# Altium project SmartWatch.PrjPcb
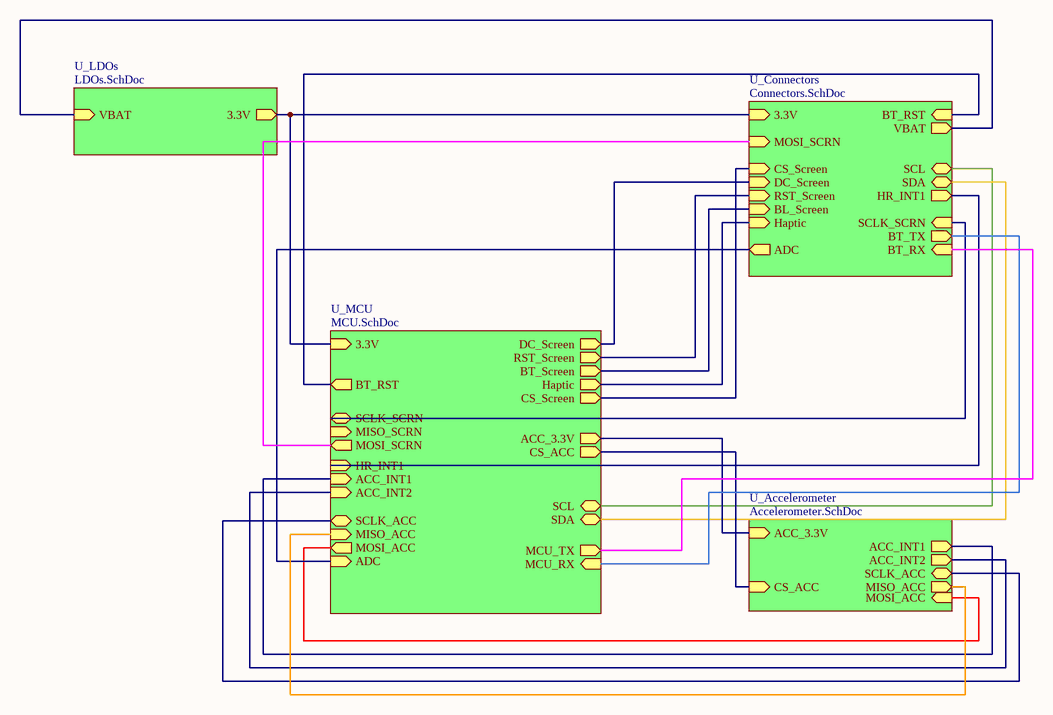
[diagram p0: TLD.SchDoc]
5 sheets, 46 parts. Net scope: hierarchical (ports join the sheet entries above them; power ports are global).
Board file: Smart_Watch.PcbDoc
Sheets:
  TLD.SchDoc
    U_Connectors = Connectors.SchDoc
    U_MCU = MCU.SchDoc
    U_Accelerometer = Accelerometer.SchDoc
    U_LDOs = LDOs.SchDoc

## Sheet TLD.SchDoc
size A; SheetNumber: 1; SheetTotal: 4

### Sub-sheets
U_Accelerometer = Accelerometer.SchDoc: ACC_INT1 (out), ACC_INT2 (out), CS_ACC (in), ACC_3.3V (in), SCLK_ACC (bidir), MISO_ACC (out), MOSI_ACC (in)
U_Connectors = Connectors.SchDoc: Haptic (in), 3.3V (in), CS_Screen (in), DC_Screen (in), RST_Screen (in), BL_Screen (in), SDA (bidir), HR_INT1 (out), SCL (bidir), BT_TX (out), BT_RX (in), VBAT (out), BT_RST (in), ADC (out), MOSI_SCRN (in), SCLK_SCRN (in)
U_LDOs = LDOs.SchDoc: 3.3V (out), VBAT (in)
U_MCU = MCU.SchDoc: 3.3V (in), Haptic (out), BT_Screen (out), RST_Screen (out), DC_Screen (out), CS_Screen (out), CS_ACC (out), HR_INT1 (in), ACC_INT1 (in), ACC_INT2 (in), ACC_3.3V (out), MCU_TX (out), MCU_RX (in), SCL (bidir), SDA (bidir), BT_RST (out), ADC (in), SCLK_SCRN (bidir), MISO_SCRN (in), MOSI_SCRN (out), SCLK_ACC (bidir), MISO_ACC (in), MOSI_ACC (out)

### Nets
3.3V: sheet U_Connectors/3.3V, sheet U_MCU/3.3V, sheet U_LDOs/3.3V
ACC_3.3V: sheet U_MCU/ACC_3.3V, sheet U_Accelerometer/ACC_3.3V
VBAT: sheet U_Connectors/VBAT, sheet U_LDOs/VBAT
ACC_INT1: sheet U_MCU/ACC_INT1, sheet U_Accelerometer/ACC_INT1
ACC_INT2: sheet U_MCU/ACC_INT2, sheet U_Accelerometer/ACC_INT2
ADC: sheet U_Connectors/ADC, sheet U_MCU/ADC
BL_Screen: sheet U_Connectors/BL_Screen, sheet U_MCU/BT_Screen
BT_RST: sheet U_Connectors/BT_RST, sheet U_MCU/BT_RST
BT_RX: sheet U_Connectors/BT_RX, sheet U_MCU/MCU_TX
BT_TX: sheet U_Connectors/BT_TX, sheet U_MCU/MCU_RX
CS_ACC: sheet U_MCU/CS_ACC, sheet U_Accelerometer/CS_ACC
CS_Screen: sheet U_Connectors/CS_Screen, sheet U_MCU/CS_Screen
DC_Screen: sheet U_Connectors/DC_Screen, sheet U_MCU/DC_Screen
Haptic: sheet U_Connectors/Haptic, sheet U_MCU/Haptic
HR_INT1: sheet U_Connectors/HR_INT1, sheet U_MCU/HR_INT1
MISO_ACC: sheet U_MCU/MISO_ACC, sheet U_Accelerometer/MISO_ACC
MOSI_ACC: sheet U_MCU/MOSI_ACC, sheet U_Accelerometer/MOSI_ACC
MOSI_SCRN: sheet U_Connectors/MOSI_SCRN, sheet U_MCU/MOSI_SCRN
RST_Screen: sheet U_Connectors/RST_Screen, sheet U_MCU/RST_Screen
SCL: sheet U_Connectors/SCL, sheet U_MCU/SCL
SCLK_ACC: sheet U_MCU/SCLK_ACC, sheet U_Accelerometer/SCLK_ACC
SCLK_SCRN: sheet U_Connectors/SCLK_SCRN, sheet U_MCU/SCLK_SCRN
SDA: sheet U_Connectors/SDA, sheet U_MCU/SDA

## Sheet Connectors.SchDoc
size A; SheetNumber: 2; SheetTotal: 4
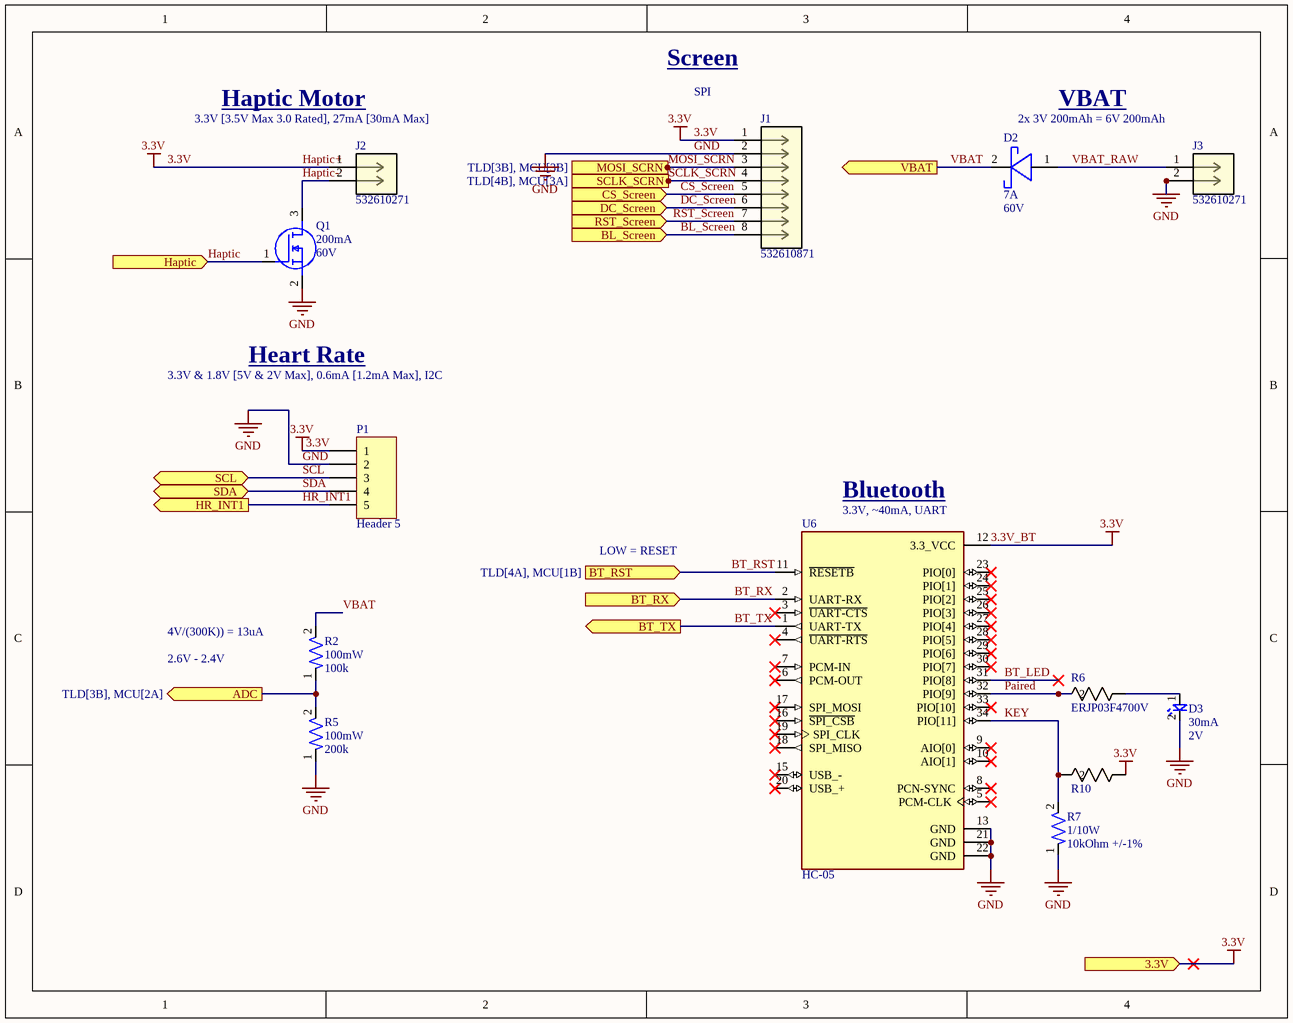
[diagram p1: Connectors.SchDoc]

### Parts
D2  Forward Current: 7A  Reverse Voltage (DC): 60V  [DO-POWERDI5]  (hidden comment: PDS760-13)
D3  Forward Current: 30mA  Forward Voltage: 2V  [LED-0603]  (hidden comment: BL-HKC36G-AV-TRB)
J1  532610871  [CONN_532610001-SD_08_MOL]
J2  532610271  [CONN_532610001-SD_02_MOL]
J3  532610271  [CONN_532610001-SD_02_MOL]
P1  Header 5  [HDR1X5]
Q1  Continuous Current: 200mA  Voltage: 60V  [IC-SOT23-3]  (hidden comment: T2N7002AK,LM)
R2  Power: 100mW  Resistance: 100k  [RES-0603]  (hidden comment: RC0603FR-07100KL)
R5  Power: 100mW  Resistance: 200k  [RES-0603]  (hidden comment: RC0603FR-07200KL)
R6  ERJP03F4700V  [RES_ERJP03_PAN]
R7  Power Rating: 1/10W  Resistance: 10kOhm +/-1%  [RES-0603]  (hidden comment: RC0603FR-0710KP)
R10  CRCW12100000Z0EA  [RES_CRCW_1210_VIS]  (value not drawn)
U6  HC-05  [XCVR_HC-05]

### Ports
3.3V (in, see TLD[3A], LDOs[1A], MCU[4D]), ADC (out, see TLD[3B], MCU[2A]), BL_Screen (in, see TLD[3B]), BT_RST (in, see TLD[4A], MCU[1B]), BT_RX (in, see TLD[4B]), BT_TX (out, see TLD[4B]), CS_Screen (in, see TLD[3B], MCU[1A]), DC_Screen (in, see TLD[3B], MCU[1A]), Haptic (in, see TLD[3B], MCU[1A]), HR_INT1 (out, see TLD[4B], MCU[1B]), MOSI_SCRN (in, see TLD[3B], MCU[3B]), RST_Screen (in, see TLD[3B], MCU[1A]), SCL (bidir, see TLD[4B], MCU[3D]), SCLK_SCRN (in, see TLD[4B], MCU[3A]), SDA (bidir, see TLD[4B], MCU[3D]), VBAT (out, see TLD[4B], LDOs[1A])

### Nets
3.3V: J1.1 J2.1 P1.1 R10.1 U6.12(3.3_VCC) ; port 3.3V  [also labelled 3.3V_BT, Haptic+]
GND: D3.2 J1.2 J3.2 P1.2 Q1.2(S) R5.1 R7.1 U6.13(GND) U6.21(GND) U6.22(GND)
VBAT: D2.2(ANODE) R2.2 ; port VBAT
ADC: R2.1 R5.2 ; port ADC
BL_Screen: J1.8 ; port BL_Screen
BT_LED: U6.31(PIO[8])
BT_RST: U6.11(~{RESETB}) ; port BT_RST
BT_RX: U6.2(UART-RX) ; port BT_RX
BT_TX: U6.1(UART-TX) ; port BT_TX
CS_Screen: J1.5 ; port CS_Screen
DC_Screen: J1.6 ; port DC_Screen
Haptic: Q1.1(G) ; port Haptic
Haptic-: J2.2 Q1.3(D)
HR_INT1: P1.5 ; port HR_INT1
KEY: R7.2 R10.2 U6.34(PIO[11])
MOSI_SCRN: J1.3 ; port MOSI_SCRN
Paired: R6.2 U6.32(PIO[9])
RST_Screen: J1.7 ; port RST_Screen
SCL: P1.3 ; port SCL
SCLK_SCRN: J1.4 ; port SCLK_SCRN
SDA: P1.4 ; port SDA
VBAT_RAW: D2.1(CATHODE) J3.1
NetD3_1: D3.1 R6.1

Not connected (* = marked no-connect by the designer): U6 3(~{UART-CTS})* 4(~{UART-RTS})* 5(PCM-CLK)* 6(PCM-OUT)* 7(PCM-IN)* 8(PCN-SYNC)* 9(AIO[0])* 10(AIO[1])* 15(USB_-)* 16(~{SPI_CSB})* 17(SPI_MOSI)* 18(SPI_MISO)* 19(SPI_CLK)* 20(USB_+)* 23(PIO[0])* 24(PIO[1])* 25(PIO[2])* 26(PIO[3])* 27(PIO[4])* 28(PIO[5])* 29(PIO[6])* 30(PIO[7])* 33(PIO[10])*

### Notes on the sheet
- Screen
- SPI
- (near J2) 3.3V [3.5V Max 3.0 Rated], 27mA [30mA Max]
- Haptic Motor
- 2x 3V 200mAh = 6V 200mAh
- VBAT
- Heart Rate
- 3.3V & 1.8V [5V & 2V Max], 0.6mA [1.2mA Max], I2C
- (near U6) Bluetooth
- LOW = RESET
- (near U6) 3.3V, ~40mA, UART
- (near R2) 4V/(300K)) = 13uA
- 2.6V - 2.4V

### Library data of the parts
D2 = DIO-SCHOTTKY-0001: DIODE SCHOTTKY 60V 7A POWERDI5; ComponentLink1Description: Datasheet; ComponentLink1URL: https://www.diodes.com/assets/Datasheets/PDS760.pdf
D3 = LED-0001: LED YELLOW CLEAR 0603 SMD; ComponentLink1Description: Datasheet; ComponentLink1URL: https://www.americanbrightled.com/pdffiles/led-components/smt/BL-HKC36G-AV-TRB.pdf
J1 = Header-PICO-8: No Description Available; Mfr_Name: Molex Connector Corporation; RefDes: RefDes; Type: Type; ComponentLink1Description: Datasheet; ComponentLink1URL: https://www.molex.com/content/dam/molex/molex-dot-com/products/automated/en-us/salesdrawingpdf/532/53261/532610871_sd.pdf?inline
J2 J3 = Header-PICO-2: No Description Available; Mfr_Name: Molex Connector Corporation; RefDes: RefDes; Type: Type; ComponentLink1Description: Datasheet; ComponentLink1URL: https://www.molex.com/content/dam/molex/molex-dot-com/products/automated/en-us/salesdrawingpdf/532/53261/532610271_sd.pdf?inline
P1 = Header 5: Header, 5-Pin; LatestRevisionDate: 17-Jul-2002; LatestRevisionNote: Re-released for DXP Platform.; Publisher: Altium Limited
Q1 = NMOS-200MA-0001: MOSFET N-CH 60V 200MA SOT23; ComponentLink1Description: Datasheet; ComponentLink1URL: https://toshiba.semicon-storage.com/info/T2N7002AK_datasheet_en_20150401.pdf?did=29712&prodName=T2N7002AK
R2 = RES-100k-0001: RES SMD 100K OHM 1% 1/10W 0603; Tolerance: 1%; Size: 0603; ComponentLink1Description: Datasheet; ComponentLink1URL: https://www.yageo.com/upload/media/product/products/datasheet/rchip/PYu-RC_Group_51_RoHS_L_12.pdf
R5 = RES-200k-0001: RES SMD 200K OHM 1% 1/10W 0603; Tolerance: 1%; Size: 0603; ComponentLink1Description: Datasheet; ComponentLink1URL: https://www.yageo.com/upload/media/product/products/datasheet/rchip/PYu-RC_Group_51_RoHS_L_12.pdf
R6 = RES-470-0603: 470 Ohms ±1% 0.2W, 1/5W Chip Resistor 0603 (1608 Metric) Automotive AEC-Q200, Pulse Withstanding Thick Film; Mfr_Name: Panasonic; ComponentLink1Description: Datasheet; ComponentLink1URL: https://industrial.panasonic.com/cdbs/www-data/pdf/RDO0000/AOA0000C331.pdf
R7 = RES-10K-0002: RES SMD 10K OHM 1% 1/10W 0603; Manufacturer: YAGEO; Assembled?: no; Manufacturer Part Number: RC0603FR-0710KP; Package Size: 0603
R10 = RES-0-1: No Description Available; Mfr_Name: Vishay; ComponentLink1Description: Datasheet; ComponentLink1URL: https://www.vishay.com/docs/20035/dcrcwe3.pdf
U6 = HC-05: Bluetooth to Serial Port Module; MF: ITead Studio; SnapEDA_Link: https://www.snapeda.com/parts/HC-05/ITEAD/view-part/?ref=snap; Package: Module ITead Studio; Value: *; MP: HC-05; Check_prices: https://www.snapeda.com/parts/HC-05/ITEAD/view-part/?ref=eda; ComponentLink1Description: Datasheet; ComponentLink1URL: https://components101.com/sites/default/files/component_datasheet/HC06%20Bluetooth%20Module%20Datasheet.pdf; ComponentLink2Description: Datasheet2; ComponentLink2URL: https://dcc-ex.com/reference/hardware/bluetooth/hc-05-06.html#gsc.tab=0

## Sheet MCU.SchDoc
size A; SheetNumber: 3; SheetTotal: 4
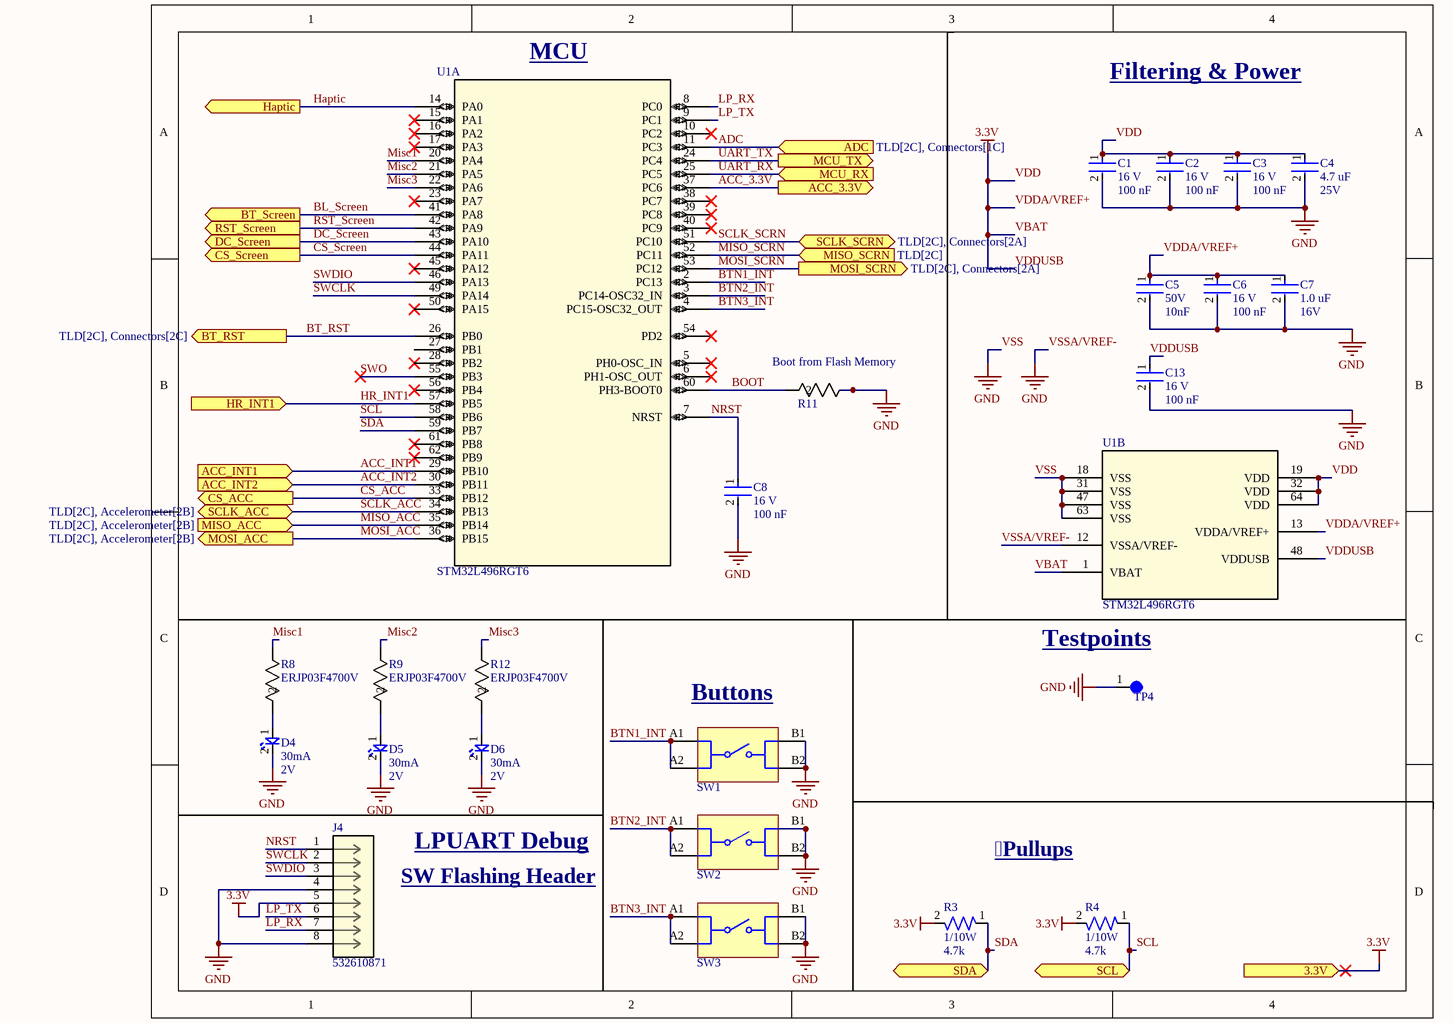
[diagram p2: MCU.SchDoc]

### Parts
C1  Voltage Rating: 16 V  Capacitance: 100 nF  [CAP-0402]  (hidden comment: CC0402KRX7R7BB104)
C2  Voltage Rating: 16 V  Capacitance: 100 nF  [CAP-0402]  (hidden comment: CC0402KRX7R7BB104)
C3  Voltage Rating: 16 V  Capacitance: 100 nF  [CAP-0402]  (hidden comment: CC0402KRX7R7BB104)
C4  Capacitance: 4.7 uF  Voltage: 25V  [CAP-0603]  (hidden comment: CC0603KRX5R8BB475)
C5  Voltage: 50V  Capacitance: 10nF  [CAP-0805]  (hidden comment: GRM2195C1H103JA01D)
C6  Voltage Rating: 16 V  Capacitance: 100 nF  [CAP-0402]  (hidden comment: CC0402KRX7R7BB104)
C7  Capacitance: 1.0 uF  Voltage: 16V  [CAP-0603]  (hidden comment: CC0603KRX7R7BB105)
C8  Voltage Rating: 16 V  Capacitance: 100 nF  [CAP-0402]  (hidden comment: CC0402KRX7R7BB104)
C13  Voltage Rating: 16 V  Capacitance: 100 nF  [CAP-0402]  (hidden comment: CC0402KRX7R7BB104)
D4  Forward Current: 30mA  Forward Voltage: 2V  [LED-0603]  (hidden comment: BL-HKC36G-AV-TRB)
D5  Forward Current: 30mA  Forward Voltage: 2V  [LED-0603]  (hidden comment: BL-HKC36G-AV-TRB)
D6  Forward Current: 30mA  Forward Voltage: 2V  [LED-0603]  (hidden comment: BL-HKC36G-AV-TRB)
J4  532610871  [CONN_532610001-SD_08_MOL]
R3  Power: 1/10W  Resistance: 4.7k  [RES-0603]  (hidden comment: RC0603FR-074K7L)
R4  Power: 1/10W  Resistance: 4.7k  [RES-0603]  (hidden comment: RC0603FR-074K7L)
R8  ERJP03F4700V  [RES_ERJP03_PAN]
R9  ERJP03F4700V  [RES_ERJP03_PAN]
R11  CRCW12100000Z0EA  [RES_CRCW_1210_VIS]  (value not drawn)
R12  ERJP03F4700V  [RES_ERJP03_PAN]
SW1  434351045816  [434351045816]  (value not drawn)
SW2  434351045816  [434351045816]  (value not drawn)
SW3  434351045816  [434351045816]  (value not drawn)
TP4  5003  [TEST-POINT-0001]  (value not drawn)
U1  STM32L496RGT6  [LQFP64-10x10mm_STM]  (parts A,B of 2)

### Ports
3.3V (in, see TLD[2B], Connectors[4D], LDOs[1A]), ACC_3.3V (out, see TLD[3C], Accelerometer[4D]), ACC_INT1 (in, see TLD[2C], Accelerometer[2B]), ACC_INT2 (in, see TLD[2C], Accelerometer[2B]), ADC (in, see TLD[2C], Connectors[1C]), BT_RST (out, see TLD[2C], Connectors[2C]), BT_Screen (out, see TLD[3B]), CS_ACC (out, see TLD[3C], Accelerometer[2B]), CS_Screen (out, see TLD[3C], Connectors[2A]), DC_Screen (out, see TLD[3B], Connectors[2A]), Haptic (out, see TLD[3C], Connectors[1B]), HR_INT1 (in, see TLD[2C], Connectors[1B]), MCU_RX (in, see TLD[3C]), MCU_TX (out, see TLD[3C]), MISO_ACC (in, see TLD[2C], Accelerometer[2B]), MISO_SCRN (in, see TLD[2C]), MOSI_ACC (out, see TLD[2C], Accelerometer[2B]), MOSI_SCRN (out, see TLD[2C], Connectors[2A]), RST_Screen (out, see TLD[3B], Connectors[2A]), SCL (bidir, see TLD[3C], Connectors[1B]), SCLK_ACC (bidir, see TLD[2C], Accelerometer[2B]), SCLK_SCRN (bidir, see TLD[2C], Connectors[2A]), SDA (bidir, see TLD[3C], Connectors[1B])

### Nets
3.3V: C1.1 C2.1 C3.1 C4.1 C5.1 C6.1 C7.1 C13.1 J4.5 R3.2 R4.2 U1.1(VBAT) U1.13(VDDA/VREF+) U1.19(VDD) U1.32(VDD) U1.48(VDDUSB) U1.64(VDD) ; port 3.3V  [also labelled VBAT, VDD, VDDA/VREF+, VDDUSB]
ACC_3.3V: U1.37(PC6) ; port ACC_3.3V
GND: C1.2 C2.2 C3.2 C4.2 C5.2 C6.2 C7.2 C8.2 C13.2 D4.2 D5.2 D6.2 J4.4 J4.8 R11.1 SW1.B1 SW1.B2 SW2.B1 SW2.B2 SW3.B1 SW3.B2 TP4.1 U1.12(VSSA/VREF-) U1.18(VSS) U1.31(VSS) U1.47(VSS) U1.63(VSS)  [also labelled VSS, VSSA/VREF-]
ACC_INT1: U1.29(PB10) ; port ACC_INT1
ACC_INT2: U1.30(PB11) ; port ACC_INT2
ADC: U1.11(PC3) ; port ADC
BL_Screen: U1.41(PA8) ; port BT_Screen
BOOT: R11.2 U1.60(PH3-BOOT0)
BT_RST: U1.26(PB0) ; port BT_RST
BTN1_INT: SW1.A1 SW1.A2 U1.2(PC13)
BTN2_INT: SW2.A1 SW2.A2 U1.3(PC14-OSC32_IN)
BTN3_INT: SW3.A1 SW3.A2 U1.4(PC15-OSC32_OUT)
CS_ACC: U1.33(PB12) ; port CS_ACC
CS_Screen: U1.44(PA11) ; port CS_Screen
DC_Screen: U1.43(PA10) ; port DC_Screen
Haptic: U1.14(PA0) ; port Haptic
HR_INT1: U1.57(PB5) ; port HR_INT1
LP_RX: J4.7 U1.8(PC0)
LP_TX: J4.6 U1.9(PC1)
Misc1: R8.1 U1.20(PA4)
Misc2: R9.1 U1.21(PA5)
Misc3: R12.1 U1.22(PA6)
MISO_ACC: U1.35(PB14) ; port MISO_ACC
MISO_SCRN: U1.52(PC11) ; port MISO_SCRN
MOSI_ACC: U1.36(PB15) ; port MOSI_ACC
MOSI_SCRN: U1.53(PC12) ; port MOSI_SCRN
NRST: C8.1 J4.1 U1.7(NRST)
RST_Screen: U1.42(PA9) ; port RST_Screen
SCL: R4.1 U1.58(PB6) ; port SCL
SCLK_ACC: U1.34(PB13) ; port SCLK_ACC
SCLK_SCRN: U1.51(PC10) ; port SCLK_SCRN
SDA: R3.1 U1.59(PB7) ; port SDA
SWCLK: J4.2 U1.49(PA14)
SWDIO: J4.3 U1.46(PA13)
SWO: U1.55(PB3)
UART_RX: U1.25(PC5) ; port MCU_RX  [project net BT_TX]
UART_TX: U1.24(PC4) ; port MCU_TX  [project net BT_RX]
NetD4_1: D4.1 R8.2
NetD5_1: D5.1 R9.2
NetD6_1: D6.1 R12.2

Not connected (* = marked no-connect by the designer): U1 5(PH0-OSC_IN)* 6(PH1-OSC_OUT)* 10(PC2)* 15(PA1)* 16(PA2)* 17(PA3)* 23(PA7)* 27(PB1) 28(PB2)* 38(PC7)* 39(PC8)* 40(PC9)* 45(PA12)* 50(PA15)* 54(PD2)* 56(PB4)* 61(PB8)* 62(PB9)*

### Notes on the sheet
- (near U1) MCU
- Filtering & Power
- (near R11) Boot from Flash Memory
- (near SW1) Buttons
- Testpoints
- SW Flashing Header
- LPUART Debug
- Pullups

### Library data of the parts
C1-C3 C6 C8 C13 = CAP-0.1U-0001: CAP CER 0.1UF 16V X7R 0402; ComponentLink2Description: Datasheet; ComponentLink2URL: https://www.yageo.com/upload/media/product/productsearch/datasheet/mlcc/UPY-GPHC_X7R_6.3V-to-250V_24.pdf; Device Class: Ceramic; Size: 0402
C4 = CAP-4.7U-0001: CAP CER 4.7UF 25V X5R 0603; Device Class: Ceramic; Size: 0603
C5 = CAP-10N-0001: CAP CER 10000PF 50V C0G/NP0 0805; Device Class: Ceramic; Size: 0805; ComponentLink1Description: Datasheet; ComponentLink1URL: https://search.murata.co.jp/Ceramy/image/img/A01X/G101/ENG/GRM2195C1H103JA01-01.pdf
C7 = CAP-1U-0002: CAP CER 1UF 16V X7R 0603; Device Class: Ceramic; Size: 0603
D4-D6 = LED-0001: LED YELLOW CLEAR 0603 SMD; ComponentLink1Description: Datasheet; ComponentLink1URL: https://www.americanbrightled.com/pdffiles/led-components/smt/BL-HKC36G-AV-TRB.pdf
J4 = Header-PICO-8: as J1 on sheet Connectors; RefDes: RefDes; Type: Type; ComponentLink1Description: Datasheet; ComponentLink1URL: https://www.molex.com/content/dam/molex/molex-dot-com/products/automated/en-us/salesdrawingpdf/532/53261/532610871_sd.pdf?inline
R3 R4 = RES-4.7k-0001: RES 4.7K OHM 1% 1/10W 0603; Tolerance: 1%; Size: 0603; ComponentLink1Description: Datasheet; ComponentLink1URL: https://www.yageo.com/upload/media/product/products/datasheet/rchip/PYu-RC_Group_51_RoHS_L_12.pdf
R8 R9 R12 = RES-470-0603: as R6 on sheet Connectors; ComponentLink1Description: Datasheet; ComponentLink1URL: https://industrial.panasonic.com/cdbs/www-data/pdf/RDO0000/AOA0000C331.pdf
R11 = RES-0-1: as R10 on sheet Connectors; ComponentLink1Description: Datasheet; ComponentLink1URL: https://www.vishay.com/docs/20035/dcrcwe3.pdf
SW1-SW3 = Button-NO-90_1: WS-TASU SMT Tact Switch 4.7x3.5mm side push, SPST-NO, 12VDC, 50mA, 160g; Manufacturer: Wurth Elektronik; Washable: No; ComponentLink1Description: Website Link; ComponentLink1URL: https://www.we-online.com/redexpert/article/434351045816?ad; ComponentLink2Description: Datasheet Link; ComponentLink2URL: https://www.we-online.com/redexpert/spec/434351045816?ad; Manufacturer Part Number: 434351045816; Category: Tact Switches; Match Code: WS-TASU; Mount: Surface Mount; Operating Temperature Max: 85°C; Operating Temperature Min: -40°C; Packaging: Tape and Reel; Length: 4.7mm; Width: 3.5mm; Height: 1.65mm; Circuit: SPST-NO; Contact Material: Stainless Steel; Contact Plating: Silver; Operation Force: 160g; Rated Current: 50mA; Rated Voltage: 12VDC; Terminal Material: Copper Alloy; Terminal Plating: Silver
TP4 = TEST-POINT-0001: Oranange PC Test Point, Miniature Phoisphor Bronze Silver Plating Through Hole Mounting Type
U1 = STM32L496RGT6: ARM® Cortex®-M4 STM32L4 Microcontroller IC 32-Bit Single-Core 80MHz 1MB (1M x 8) FLASH 64-LQFP (10x10); Mfr_Name: STMicroelectronics; RefDes: RefDes; Type: Type; ComponentLink1Description: Datasheet; ComponentLink1URL: https://www.st.com/resource/en/datasheet/stm32l496ae.pdf

## Sheet Accelerometer.SchDoc
size A; SheetNumber: 4; SheetTotal: 5
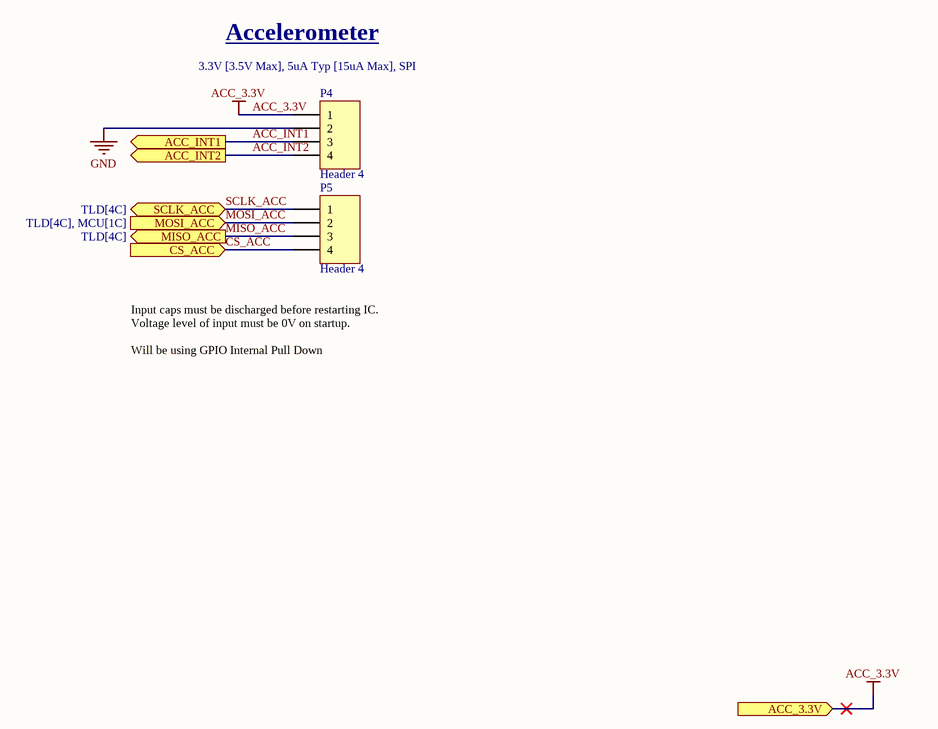
[diagram p3: Accelerometer.SchDoc]

### Parts
P4  Header 4  [HDR1X4]
P5  Header 4  [HDR1X4]

### Ports
ACC_3.3V (in, see TLD[3C], MCU[2A]), ACC_INT1 (out, see TLD[4C], MCU[1B]), ACC_INT2 (out, see TLD[4C], MCU[1B]), CS_ACC (in, see TLD[3C], MCU[1B]), MISO_ACC (out, see TLD[4C]), MOSI_ACC (in, see TLD[4C], MCU[1C]), SCLK_ACC (bidir, see TLD[4C])

### Nets
ACC_3.3V: P4.1 ; port ACC_3.3V
GND: P4.2
ACC_INT1: P4.3 ; port ACC_INT1
ACC_INT2: P4.4 ; port ACC_INT2
CS_ACC: P5.4 ; port CS_ACC
MISO_ACC: P5.3 ; port MISO_ACC
MOSI_ACC: P5.2 ; port MOSI_ACC
SCLK_ACC: P5.1 ; port SCLK_ACC

### Notes on the sheet
- (near P4) 3.3V [3.5V Max], 5uA Typ [15uA Max], SPI
- Accelerometer
- (near P5) Input caps must be discharged before restarting IC.
  Voltage level of input must be 0V on startup.
  Will be using GPIO Internal Pull Down

### Library data of the parts
P4 P5 = Header 4: Header, 4-Pin; LatestRevisionDate: 17-Jul-2002; LatestRevisionNote: Re-released for DXP Platform.; Publisher: Altium Limited

## Sheet LDOs.SchDoc
size A; SheetNumber: 5; SheetTotal: 4
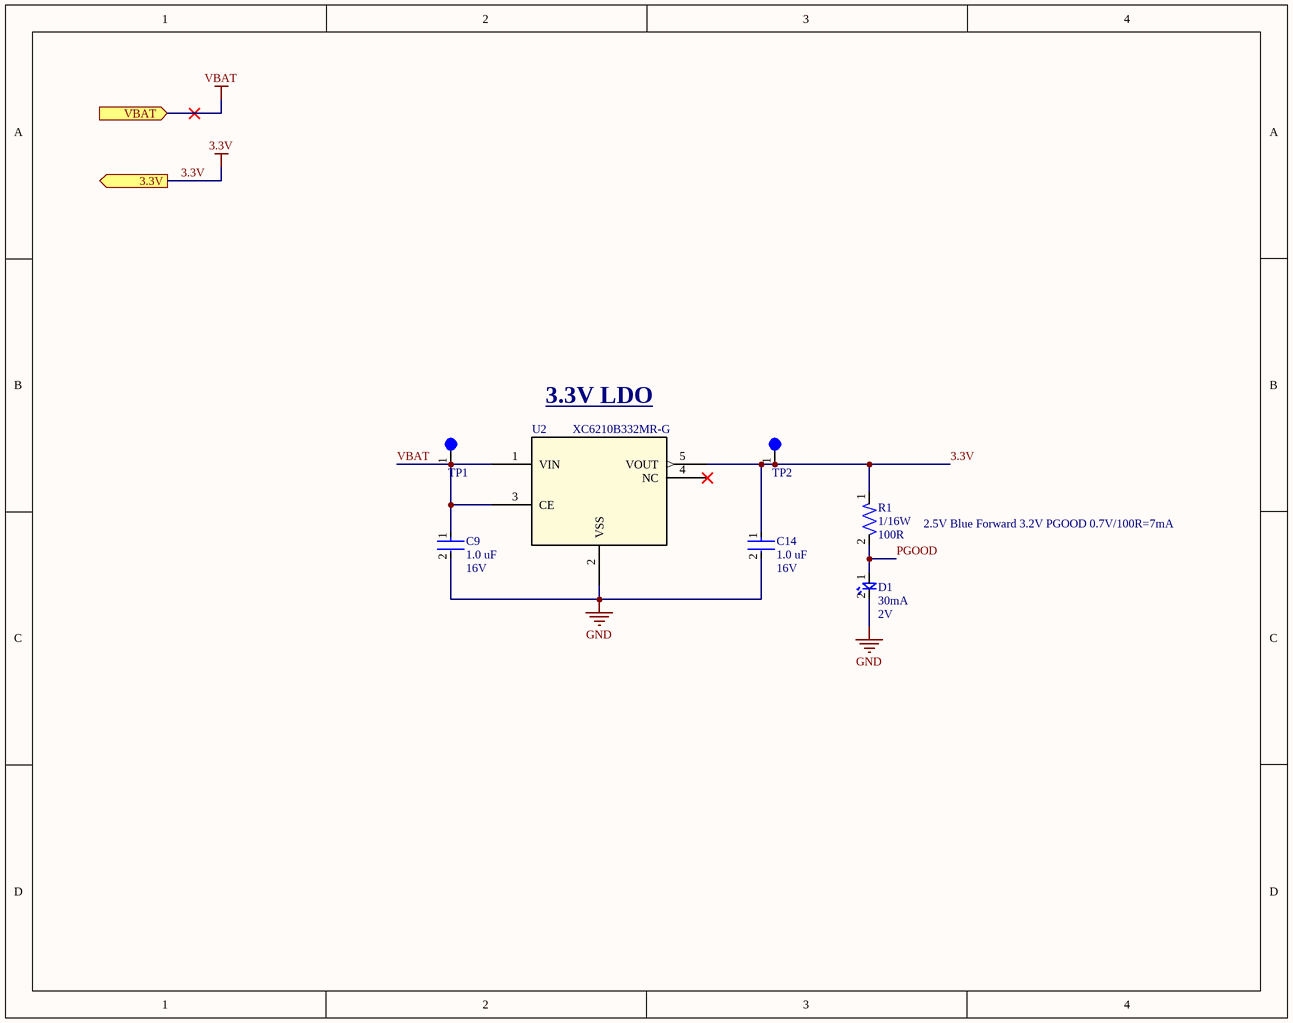
[diagram p4: LDOs.SchDoc]

### Parts
C9  Capacitance: 1.0 uF  Voltage: 16V  [CAP-0603]  (hidden comment: CC0603KRX7R7BB105)
C14  Capacitance: 1.0 uF  Voltage: 16V  [CAP-0603]  (hidden comment: CC0603KRX7R7BB105)
D1  Forward Current: 30mA  Forward Voltage: 2V  [LED-0603]  (hidden comment: BL-HKC36G-AV-TRB)
R1  Power: 1/16W  Resistance: 100R  [RES-0402]  (hidden comment: RC0402FR-07100RL)
TP1  5003  [TEST-POINT-0001]  (value not drawn)
TP2  5003  [TEST-POINT-0001]  (value not drawn)
U2  XC6210B332MR-G  [SOT-25_TOR]

### Ports
3.3V (out, see TLD[2A], Connectors[4D], MCU[4D]), VBAT (in, see TLD[1A], Connectors[3A])

### Nets
3.3V: C14.1 R1.1 TP2.1 U2.5(VOUT) ; port 3.3V
GND: C9.2 C14.2 D1.2 U2.2(VSS)
VBAT: C9.1 TP1.1 U2.1(VIN) U2.3(CE) ; port VBAT
PGOOD: D1.1 R1.2

Not connected (* = marked no-connect by the designer): U2 4(NC)*

### Notes on the sheet
- 3.3V LDO
- 2.5V Blue Forward 3.2V PGOOD 0.7V/100R=7mA

### Library data of the parts
C9 C14 = CAP-1U-0002: CAP CER 1UF 16V X7R 0603; Device Class: Ceramic; Size: 0603
D1 = LED-0001: LED YELLOW CLEAR 0603 SMD; ComponentLink1Description: Datasheet; ComponentLink1URL: https://www.americanbrightled.com/pdffiles/led-components/smt/BL-HKC36G-AV-TRB.pdf
R1 = RES-100-0001: RES 100 OHM 1% 1/16W 0402; Tolerance: 1%; Size: 0402; ComponentLink1Description: Datasheet; ComponentLink1URL: https://www.yageo.com/upload/media/product/products/datasheet/rchip/PYu-RC_Group_51_RoHS_L_12.pdf
TP1 TP2 = TEST-POINT-0001: as TP4 on sheet MCU
U2 = LDO-3.3V_1: Linear Voltage Regulator IC Positive Fixed 1 Output 700mA SOT-25-5; Mfr_Name: Torex Semiconductor; RefDes: RefDes; Type: Type; ComponentLink1Description: Datasheet; ComponentLink1URL: https://product.torexsemi.com/system/files/series/xc6210.pdf

## Nets that join several sheets
3.3V: Connectors (5 pins), MCU (17 pins), LDOs (C14.1 R1.1 TP2.1 U2.5)
ACC_3.3V: MCU (U1.37), Accelerometer (P4.1)
GND: Connectors (10 pins), MCU (27 pins), Accelerometer (P4.2), LDOs (C9.2 C14.2 D1.2 U2.2)
VBAT: Connectors (D2.2 R2.2), LDOs (C9.1 TP1.1 U2.1 U2.3)
ACC_INT1: MCU (U1.29), Accelerometer (P4.3)
ACC_INT2: MCU (U1.30), Accelerometer (P4.4)
ADC: Connectors (R2.1 R5.2), MCU (U1.11)
BL_Screen: Connectors (J1.8), MCU (U1.41)
BT_RST: Connectors (U6.11), MCU (U1.26)
BT_RX: Connectors (U6.2), MCU (U1.24)
BT_TX: Connectors (U6.1), MCU (U1.25)
CS_ACC: MCU (U1.33), Accelerometer (P5.4)
CS_Screen: Connectors (J1.5), MCU (U1.44)
DC_Screen: Connectors (J1.6), MCU (U1.43)
Haptic: Connectors (Q1.1), MCU (U1.14)
HR_INT1: Connectors (P1.5), MCU (U1.57)
MISO_ACC: MCU (U1.35), Accelerometer (P5.3)
MOSI_ACC: MCU (U1.36), Accelerometer (P5.2)
MOSI_SCRN: Connectors (J1.3), MCU (U1.53)
RST_Screen: Connectors (J1.7), MCU (U1.42)
SCL: Connectors (P1.3), MCU (R4.1 U1.58)
SCLK_ACC: MCU (U1.34), Accelerometer (P5.1)
SCLK_SCRN: Connectors (J1.4), MCU (U1.51)
SDA: Connectors (P1.4), MCU (R3.1 U1.59)